# EAGLE schematic LDR array (EAGLE 8.6.3)
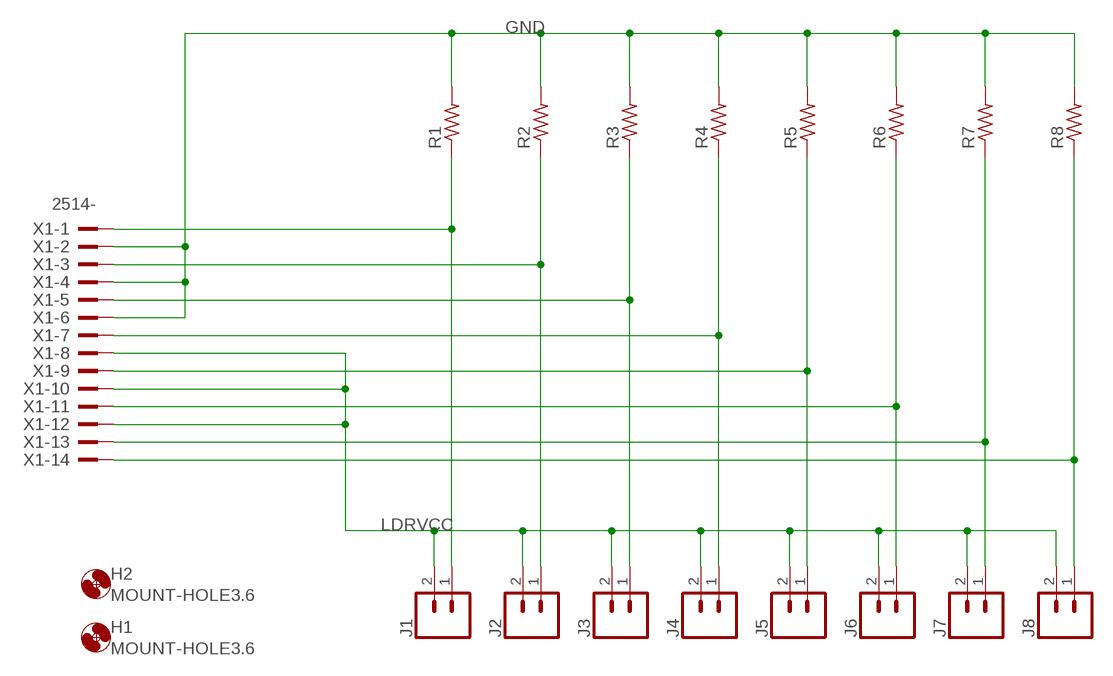
[diagram p0: schematic, sheet 1]

## Parts
H1  MOUNT-HOLE3.6  [3,6]
H2  MOUNT-HOLE3.6  [3,6]
J1  CONN_023.5MM_LOCK  [SCREWTERMINAL-3.5MM-2_LOCK]
J2  CONN_023.5MM_LOCK  [SCREWTERMINAL-3.5MM-2_LOCK]
J3  CONN_023.5MM_LOCK  [SCREWTERMINAL-3.5MM-2_LOCK]
J4  CONN_023.5MM_LOCK  [SCREWTERMINAL-3.5MM-2_LOCK]
J5  CONN_023.5MM_LOCK  [SCREWTERMINAL-3.5MM-2_LOCK]
J6  CONN_023.5MM_LOCK  [SCREWTERMINAL-3.5MM-2_LOCK]
J7  CONN_023.5MM_LOCK  [SCREWTERMINAL-3.5MM-2_LOCK]
J8  CONN_023.5MM_LOCK  [SCREWTERMINAL-3.5MM-2_LOCK]
R1  R-US_0204/7  [0204/7]
R2  R-US_0204/7  [0204/7]
R3  R-US_0204/7  [0204/7]
R4  R-US_0204/7  [0204/7]
R5  R-US_0204/7  [0204/7]
R6  R-US_0204/7  [0204/7]
R7  R-US_0204/7  [0204/7]
R8  R-US_0204/7  [0204/7]
X1  2514-  [PAK100/2500-14]

## Nets
GND: R1.2 R2.2 R3.2 R4.2 R5.2 R6.2 R7.2 R8.2 X1.2 X1.4 X1.6
LDRVCC: J1.2 J2.2 J3.2 J4.2 J5.2 J6.2 J7.2 J8.2 X1.8 X1.10 X1.12
N$1: J1.1 R1.1 X1.1
N$2: J2.1 R2.1 X1.3
N$3: J3.1 R3.1 X1.5
N$4: J4.1 R4.1 X1.7
N$5: J5.1 R5.1 X1.9
N$6: J6.1 R6.1 X1.11
N$7: J7.1 R7.1 X1.13
N$8: J8.1 R8.1 X1.14

## Library data of the parts
H1 H2 = holes:MOUNT-HOLE: MOUNTING HOLE with drill center marker
J1-J8 = SparkFun-Connectors:CONN_02: Multi connection point. Often used as Generic Header-pin footprint for 0.1 inch spaced/style header connections On any of the 0.1 inch spaced packages, you can populate with these: Break Away Headers - Straight <https://www.sparkfun.com/products/116> (PRT-00116) Break Away Male Headers - Right Angle <https://www.sparkfun.com/products/553> (PRT-00553) Female Headers <https://www.sparkfun.com/products/115> (PRT-00115) Break Away Headers - Machine Pin <https://www.sparkfun.com/products/117> (PRT-00117) Break Away Female Headers - Swiss Machine Pin <https://www.sparkfun.com/products/743> (PRT-00743) For SCREWTERMINALS and SPRING TERMINALS visit here: Screw Terimnals on SparkFun.com <https://www.sparkfun.com/search/results?term=Screw+Terminals> (5mm/3.5mm/2.54mm spacing) This device is also useful as a general connection point to wire up your design to another part of your project. Our various solder wires solder well into these plated through hole pads. Hook-Up Wire - Assortment (Stranded, 22 AWG) <https://www.sparkfun.com/products/11375> (PRT-11375) Hook-Up Wire - Assortment (Solid Core, 22 AWG) <https://www.sparkfun.com/products/11367> (PRT-11367) View the entire wire category on our website here <https://www.sparkfun.com/categories/141> Special notes: Molex polarized connector foot print use with: PRT-08233 with associated crimp pins and housings. 2.54_SCREWTERM for use with PRT-10571. 3.5mm Screw Terminal footprints for PRT-08084 5mm Screw Terminal footprints for use with PRT-08432; PROD_ID: CONN-08399
R1-R8 = rcl:R-US_: RESISTOR, American symbol; SPICEPREFIX: R
X1 = con-3m:2514-: 3M (TM) Pak 100 4-Wall Header Source: 3M; OC_FARNELL: unknown; OC_NEWARK: unknown